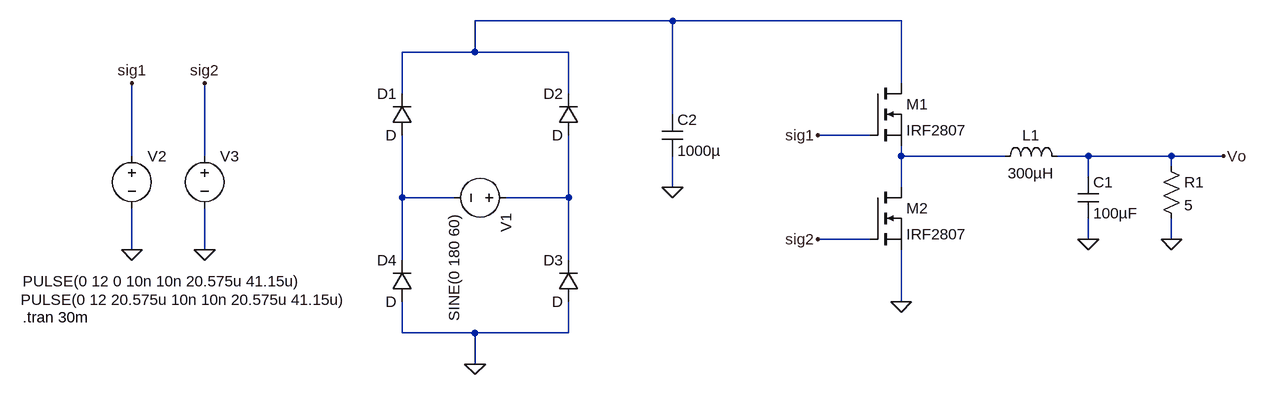
[diagram p0: schematic buck_rede.asc]
buck_rede.asc, the LTspice schematic file:
Version 4
SHEET 1 880 680
WIRE -112 -64 -416 -64
WIRE 240 -64 -112 -64
WIRE -416 -16 -416 -64
WIRE -416 -16 -528 -16
WIRE -272 -16 -416 -16
WIRE 240 32 240 -64
WIRE -528 48 -528 -16
WIRE -272 48 -272 -16
WIRE -112 80 -112 -64
WIRE 192 112 112 112
WIRE -944 144 -944 32
WIRE -832 144 -832 32
WIRE 240 144 240 128
WIRE 400 144 240 144
WIRE 528 144 480 144
WIRE 656 144 528 144
WIRE 736 144 656 144
WIRE 656 160 656 144
WIRE 528 176 528 144
WIRE -112 192 -112 144
WIRE 240 192 240 144
WIRE -528 208 -528 112
WIRE -448 208 -528 208
WIRE -272 208 -272 112
WIRE -272 208 -368 208
WIRE 192 272 112 272
WIRE 528 272 528 240
WIRE 656 272 656 240
WIRE -944 288 -944 224
WIRE -832 288 -832 224
WIRE -528 304 -528 208
WIRE -272 304 -272 208
WIRE 240 368 240 288
WIRE -528 416 -528 368
WIRE -416 416 -528 416
WIRE -272 416 -272 368
WIRE -272 416 -416 416
WIRE -416 464 -416 416
FLAG 240 368 0
FLAG -944 288 0
FLAG 112 112 sig1
FLAG -944 32 sig1
FLAG 112 272 sig2
FLAG -832 288 0
FLAG -832 32 sig2
FLAG 528 272 0
FLAG 656 272 0
FLAG 736 144 Vo
FLAG -112 192 0
FLAG -416 464 0
SYMBOL nmos 192 32 R0
SYMATTR InstName M1
SYMATTR Value IRF2807
SYMBOL nmos 192 192 R0
SYMATTR InstName M2
SYMATTR Value IRF2807
SYMBOL voltage -352 208 R90
WINDOW 123 0 0 Left 2
WINDOW 39 0 0 Left 2
SYMATTR InstName V1
SYMATTR Value SINE(0 180 60)
SYMBOL voltage -944 128 R0
WINDOW 3 -168 209 Left 2
WINDOW 123 0 0 Left 2
WINDOW 39 0 0 Left 2
SYMATTR Value PULSE(0 12 0 10n 10n 20.575u 41.15u)
SYMATTR InstName V2
SYMBOL voltage -832 128 R0
WINDOW 3 -283 237 Left 2
WINDOW 123 0 0 Left 2
WINDOW 39 0 0 Left 2
SYMATTR Value PULSE(0 12 20.575u 10n 10n 20.575u 41.15u)
SYMATTR InstName V3
SYMBOL ind 384 160 R270
WINDOW 0 32 56 VTop 2
WINDOW 3 5 56 VBottom 2
SYMATTR InstName L1
SYMATTR Value 300µH
SYMBOL cap 512 176 R0
SYMATTR InstName C1
SYMATTR Value 100µF
SYMBOL res 640 144 R0
SYMATTR InstName R1
SYMATTR Value 5
SYMBOL cap -128 80 R0
SYMATTR InstName C2
SYMATTR Value 1000µ
SYMBOL diode -512 112 R180
WINDOW 0 24 64 Left 2
WINDOW 3 24 0 Left 2
SYMATTR InstName D1
SYMBOL diode -256 112 R180
WINDOW 0 24 64 Left 2
WINDOW 3 24 0 Left 2
SYMATTR InstName D2
SYMBOL diode -256 368 R180
WINDOW 0 24 64 Left 2
WINDOW 3 24 0 Left 2
SYMATTR InstName D3
SYMBOL diode -512 368 R180
WINDOW 0 24 64 Left 2
WINDOW 3 24 0 Left 2
SYMATTR InstName D4
TEXT -1112 392 Left 2 !.tran 30m

The netlist it stands for:
* buck_rede.asc
M1 N001 sig1 N002 N002 IRF2807
M2 N002 sig2 0 0 IRF2807
V1 N004 N003 SINE(0 180 60)
V2 sig1 0 PULSE(0 12 0 10n 10n 20.575u 41.15u)
V3 sig2 0 PULSE(0 12 20.575u 10n 10n 20.575u 41.15u)
L1 N002 Vo 300µH
C1 Vo 0 100µF
R1 Vo 0 5
C2 N001 0 1000µ
D1 N003 N001 D
D2 N004 N001 D
D3 0 N004 D
D4 0 N003 D
.model D D
.lib standard.dio
.model NMOS NMOS
.model PMOS PMOS
.lib standard.mos
.tran 30m
.backanno
.end